# EAGLE schematic p8x-memory-card (EAGLE 9.6.2)
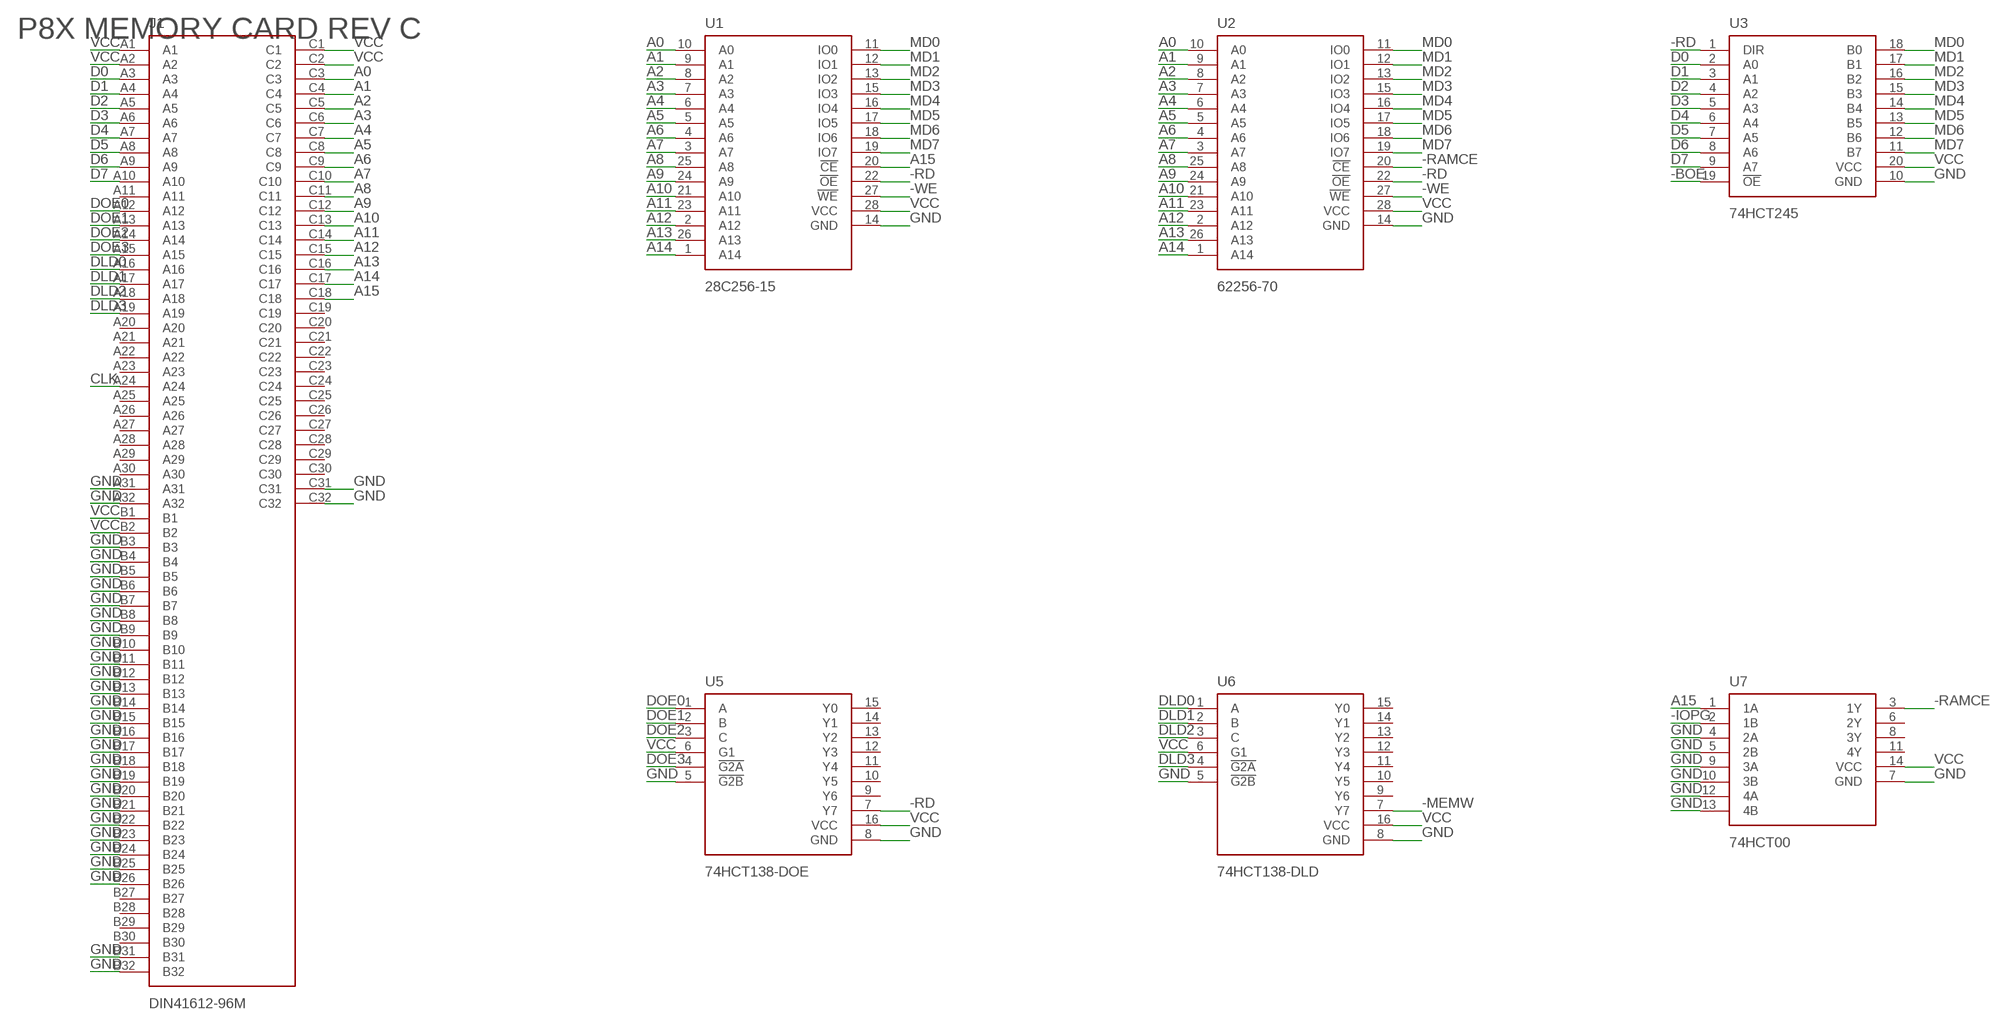
[diagram p0: schematic, sheet 1, part 1 of 2]
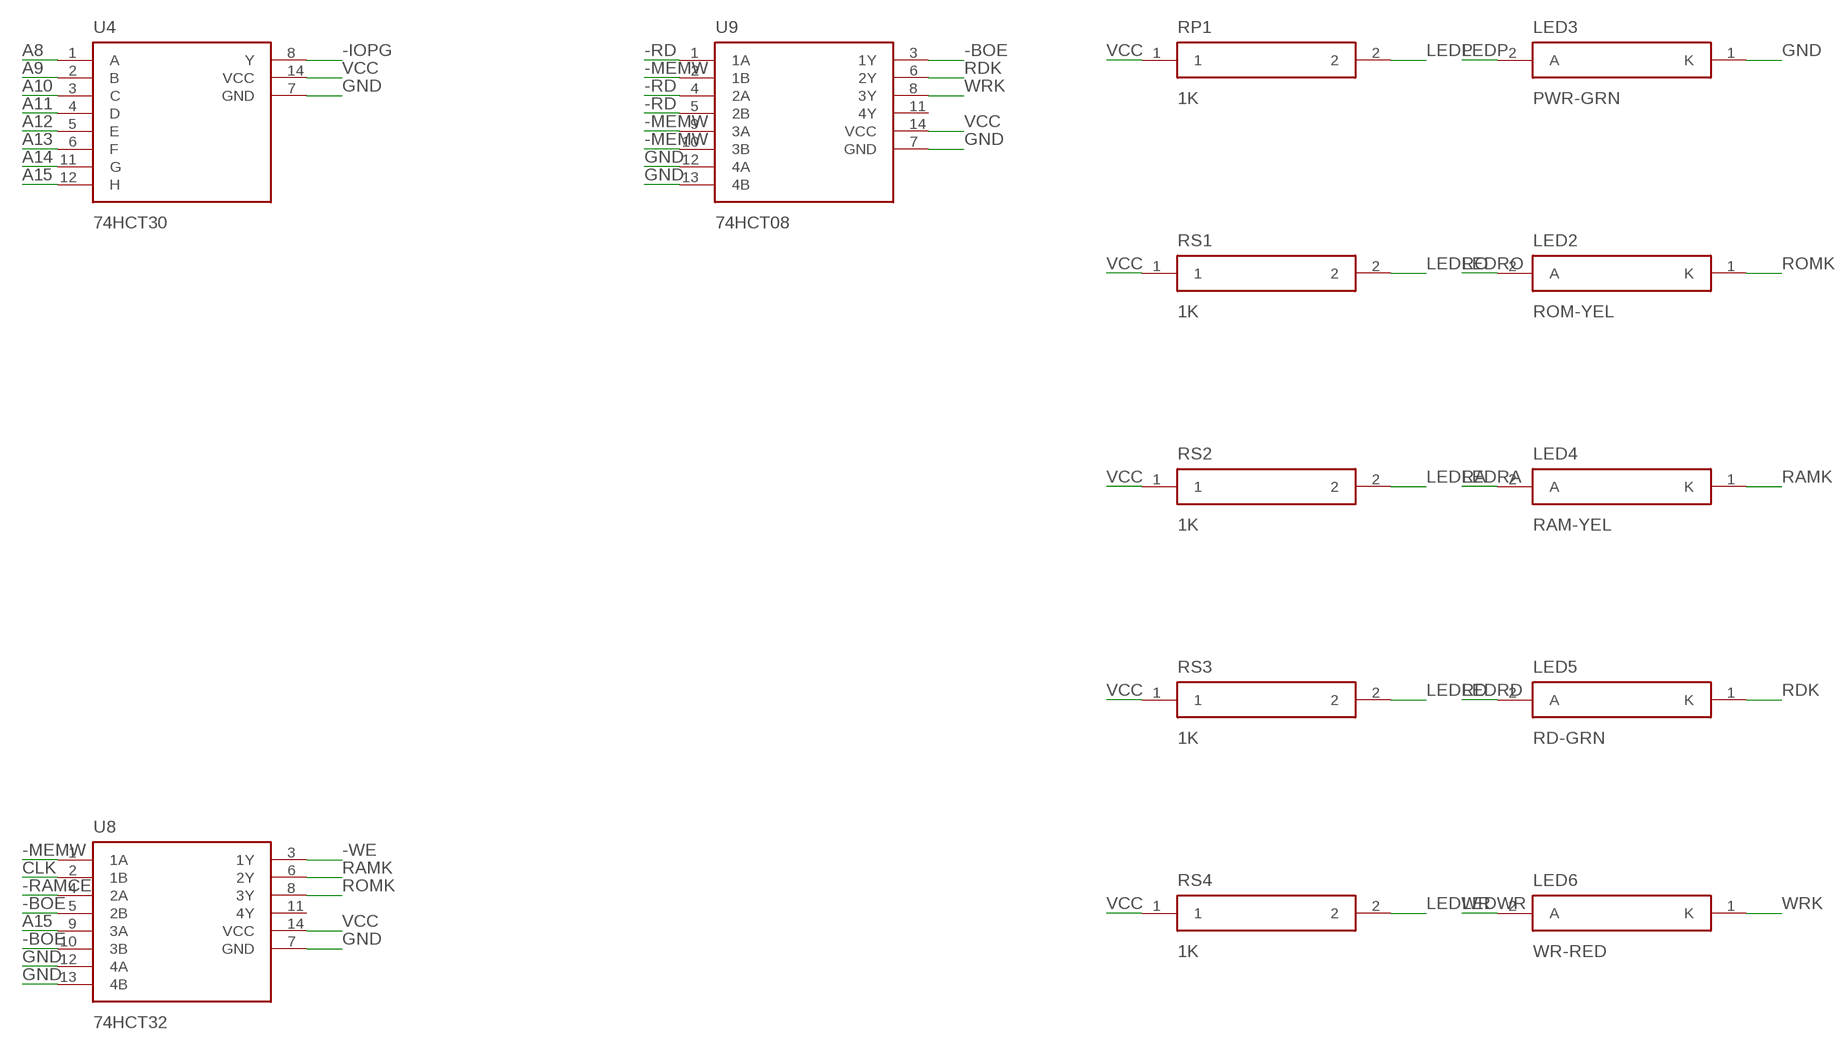
[diagram p1: schematic, sheet 1, part 2 of 2]

## Parts
J1  DIN41612-96M  DIN96  [DIN96]
LED2  ROM-YEL  LED  [LED5]
LED3  PWR-GRN  LED  [LED5]
LED4  RAM-YEL  LED  [LED5]
LED5  RD-GRN  LED  [LED5]
LED6  WR-RED  LED  [LED5]
RP1  1K  RES  [R_AXIAL]
RS1  1K  RES  [R_AXIAL]
RS2  1K  RES  [R_AXIAL]
RS3  1K  RES  [R_AXIAL]
RS4  1K  RES  [R_AXIAL]
U1  28C256-15  MEM28K8  [DIP28W]
U2  62256-70  MEM28K8  [DIP28W]
U3  74HCT245  74245  [DIP20]
U4  74HCT30  7430  [DIP14]
U5  74HCT138-DOE  74138  [DIP16]
U6  74HCT138-DLD  74138  [DIP16]
U7  74HCT00  GATES14  [DIP14]
U8  74HCT32  GATES14  [DIP14]
U9  74HCT08  GATES14  [DIP14]

## Nets
-BOE: U3.19(!OE) U8.5(2B) U8.10(3B) U9.3(1Y)
-IOPG: U4.8(Y) U7.2(1B)
-MEMW: U6.7(Y7) U8.1(1A) U9.2(1B) U9.9(3A) U9.10(3B)
-RAMCE: U2.20(!CE) U7.3(1Y) U8.4(2A)
-RD: U1.22(!OE) U2.22(!OE) U3.1(DIR) U5.7(Y7) U9.1(1A) U9.4(2A) U9.5(2B)
-WE: U1.27(!WE) U2.27(!WE) U8.3(1Y)
A0: J1.C3 U1.10(A0) U2.10(A0)
A1: J1.C4 U1.9(A1) U2.9(A1)
A2: J1.C5 U1.8(A2) U2.8(A2)
A3: J1.C6 U1.7(A3) U2.7(A3)
A4: J1.C7 U1.6(A4) U2.6(A4)
A5: J1.C8 U1.5(A5) U2.5(A5)
A6: J1.C9 U1.4(A6) U2.4(A6)
A7: J1.C10 U1.3(A7) U2.3(A7)
A8: J1.C11 U1.25(A8) U2.25(A8) U4.1(A)
A9: J1.C12 U1.24(A9) U2.24(A9) U4.2(B)
A10: J1.C13 U1.21(A10) U2.21(A10) U4.3(C)
A11: J1.C14 U1.23(A11) U2.23(A11) U4.4(D)
A12: J1.C15 U1.2(A12) U2.2(A12) U4.5(E)
A13: J1.C16 U1.26(A13) U2.26(A13) U4.6(F)
A14: J1.C17 U1.1(A14) U2.1(A14) U4.11(G)
A15: J1.C18 U1.20(!CE) U4.12(H) U7.1(1A) U8.9(3A)
CLK: J1.A24 U8.2(1B)
D0: J1.A3 U3.2(A0)
D1: J1.A4 U3.3(A1)
D2: J1.A5 U3.4(A2)
D3: J1.A6 U3.5(A3)
D4: J1.A7 U3.6(A4)
D5: J1.A8 U3.7(A5)
D6: J1.A9 U3.8(A6)
D7: J1.A10 U3.9(A7)
DLD0: J1.A16 U6.1(A)
DLD1: J1.A17 U6.2(B)
DLD2: J1.A18 U6.3(C)
DLD3: J1.A19 U6.4(!G2A)
DOE0: J1.A12 U5.1(A)
DOE1: J1.A13 U5.2(B)
DOE2: J1.A14 U5.3(C)
DOE3: J1.A15 U5.4(!G2A)
GND: J1.A31 J1.A32 J1.B3 J1.B4 J1.B5 J1.B6 J1.B7 J1.B8 J1.B9 J1.B10 J1.B11 J1.B12 J1.B13 J1.B14 J1.B15 J1.B16 J1.B17 J1.B18 J1.B19 J1.B20 J1.B21 J1.B22 J1.B23 J1.B24 J1.B25 J1.B26 J1.B31 J1.B32 J1.C31 J1.C32 LED3.1(K) U1.14(GND) U2.14(GND) U3.10(GND) U4.7(GND) U5.5(!G2B) U5.8(GND) U6.5(!G2B) U6.8(GND) U7.4(2A) U7.5(2B) U7.7(GND) U7.9(3A) U7.10(3B) U7.12(4A) U7.13(4B) U8.7(GND) U8.12(4A) U8.13(4B) U9.7(GND) U9.12(4A) U9.13(4B)
LEDP: LED3.2(A) RP1.2
LEDRA: LED4.2(A) RS2.2
LEDRD: LED5.2(A) RS3.2
LEDRO: LED2.2(A) RS1.2
LEDWR: LED6.2(A) RS4.2
MD0: U1.11(IO0) U2.11(IO0) U3.18(B0)
MD1: U1.12(IO1) U2.12(IO1) U3.17(B1)
MD2: U1.13(IO2) U2.13(IO2) U3.16(B2)
MD3: U1.15(IO3) U2.15(IO3) U3.15(B3)
MD4: U1.16(IO4) U2.16(IO4) U3.14(B4)
MD5: U1.17(IO5) U2.17(IO5) U3.13(B5)
MD6: U1.18(IO6) U2.18(IO6) U3.12(B6)
MD7: U1.19(IO7) U2.19(IO7) U3.11(B7)
RAMK: LED4.1(K) U8.6(2Y)
RDK: LED5.1(K) U9.6(2Y)
ROMK: LED2.1(K) U8.8(3Y)
VCC: J1.A1 J1.A2 J1.B1 J1.B2 J1.C1 J1.C2 RP1.1 RS1.1 RS2.1 RS3.1 RS4.1 U1.28(VCC) U2.28(VCC) U3.20(VCC) U4.14(VCC) U5.6(G1) U5.16(VCC) U6.6(G1) U6.16(VCC) U7.14(VCC) U8.14(VCC) U9.14(VCC)
WRK: LED6.1(K) U9.8(3Y)
Unconnected: J1.A11 J1.A20 J1.A21 J1.A22 J1.A23 J1.A25 J1.A26 J1.A27 J1.A28 J1.A29 J1.A30 J1.B27 J1.B28 J1.B29 J1.B30 J1.C19 J1.C20 J1.C21 J1.C22 J1.C23 J1.C24 J1.C25 J1.C26 J1.C27 J1.C28 J1.C29 J1.C30 U5.9(Y6) U5.10(Y5) U5.11(Y4) U5.12(Y3) U5.13(Y2) U5.14(Y1) U5.15(Y0) U6.9(Y6) U6.10(Y5) U6.11(Y4) U6.12(Y3) U6.13(Y2) U6.14(Y1) U6.15(Y0) U7.6(2Y) U7.8(3Y) U7.11(4Y) U8.11(4Y) U9.11(4Y)

## Notes on the sheet
- P8X MEMORY CARD REV C

## Library data of the parts
J1 = p8x:DIN96
LED2-LED6 = p8x:LED
RP1 RS1-RS4 = p8x:RES
U1 U2 = p8x:MEM28K8
U3 = p8x:74245
U4 = p8x:7430
U5 U6 = p8x:74138
U7-U9 = p8x:GATES14